# EAGLE design DomBoard (EAGLE 7.7.0)

## Sheet 1 of 2
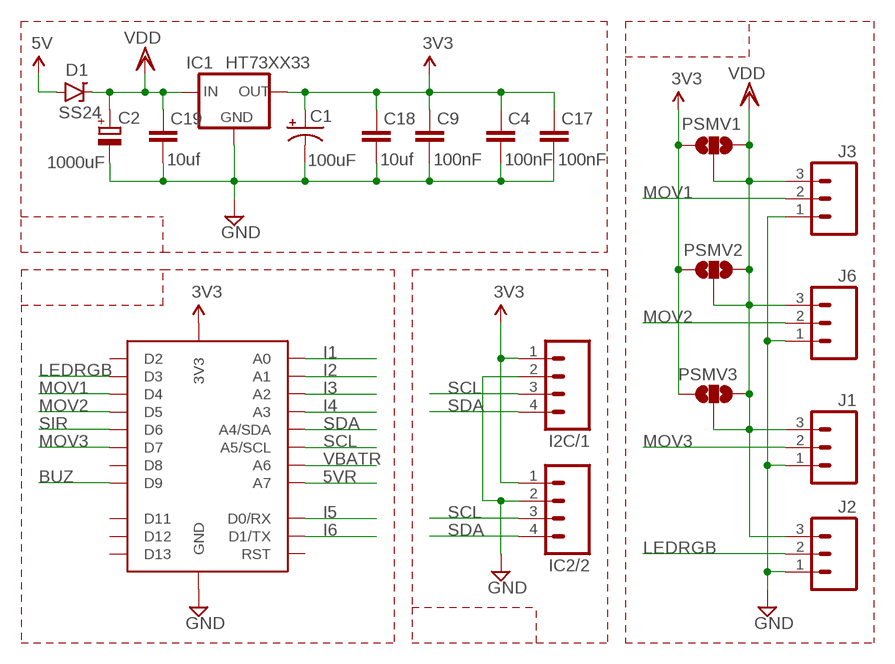
[diagram p0: schematic, sheet 1]

### Parts
C1  100uF  CAP_POL3528-KIT  [EIA3528-KIT]
C2  1000uF  CPOL-EUE5-8.5  [E5-8,5]
C4  100nF  C-EUC0805K  [C0805K]
C9  100nF  C-EUC0805K  [C0805K]
C17  100nF  C-EUC0805K  [C0805K]
C18  10uf  C-EUC0805K  [C0805K]
C19  10uf  C-EUC0805K  [C0805K]
D1  SS24  [DO-214AA(1)]
I2C/1  M04PTH  [1X04]
IC1  HT73XX33  [SOT-89]
IC2/2  M04PTH  [1X04]
J1  M03JST-PTH-VERT  [JST-3-PTH-VERT]
J2  M03JST-PTH-VERT  [JST-3-PTH-VERT]
J3  M03JST-PTH-VERT  [JST-3-PTH-VERT]
J6  M03JST-PTH-VERT  [JST-3-PTH-VERT]
PROMINI69  PROMINI69  [PROMINI69]
PSMV1  JUMPER-PAD-3-NC_BY_TRACE  [PAD-JUMPER-3-3OF3_NC_BY_TRACE_YES_SILK_FULL_BOX]
PSMV2  JUMPER-PAD-3-NC_BY_TRACE  [PAD-JUMPER-3-3OF3_NC_BY_TRACE_YES_SILK_FULL_BOX]
PSMV3  JUMPER-PAD-3-NC_BY_TRACE  [PAD-JUMPER-3-3OF3_NC_BY_TRACE_YES_SILK_FULL_BOX]

### Nets
3.3V [3.3V]: C1.A(+) C4.2 C9.2 C17.2 C18.2 I2C/1.1 IC1.1(OUT) IC2/2.1 PROMINI69.3V3 PSMV1.1 PSMV2.1 PSMV3.1 ; supply symbol labelled 3V3 ; also sheet 2
5V [5V]: D1.A ; also sheet 2
5VR: PROMINI69.A7 ; also sheet 2
BUZ: PROMINI69.D9 ; also sheet 2
GND [GND]: C1.C(-) C2.- C4.1 C9.1 C17.1 C18.1 C19.1 I2C/1.2 IC1.2(GND) IC2/2.2 J1.1 J2.1 J3.1 J6.1 PROMINI69.GND ; also sheet 2
I1: PROMINI69.A0 ; also sheet 2
I2: PROMINI69.A1 ; also sheet 2
I3: PROMINI69.A2 ; also sheet 2
I4: PROMINI69.A3 ; also sheet 2
I5: PROMINI69.D0(D0/RX) ; also sheet 2
I6: PROMINI69.D1(D1/TX) ; also sheet 2
LEDRGB: J2.2 PROMINI69.D3
MOV1: J3.2 PROMINI69.D4
MOV2: J6.2 PROMINI69.D5
MOV3: J1.2 PROMINI69.D7
SCL: I2C/1.3 IC2/2.3 PROMINI69.A5(A5/SCL) ; also sheet 2
SDA: I2C/1.4 IC2/2.4 PROMINI69.A4(A4/SDA) ; also sheet 2
SIR: PROMINI69.D6 ; also sheet 2
VBATR: PROMINI69.A6 ; also sheet 2
VDD [VDD]: C2.+ C19.2 D1.C IC1.3(IN) IC1.4(IN) J1.3 J2.3 J3.3 J6.3 PSMV1.2 PSMV1.3 PSMV2.2 PSMV2.3 PSMV3.2 PSMV3.3 ; also sheet 2
Unconnected: PROMINI69.D2 PROMINI69.D8 PROMINI69.D11 PROMINI69.D12 PROMINI69.D13 PROMINI69.RST

## Sheet 2 of 2
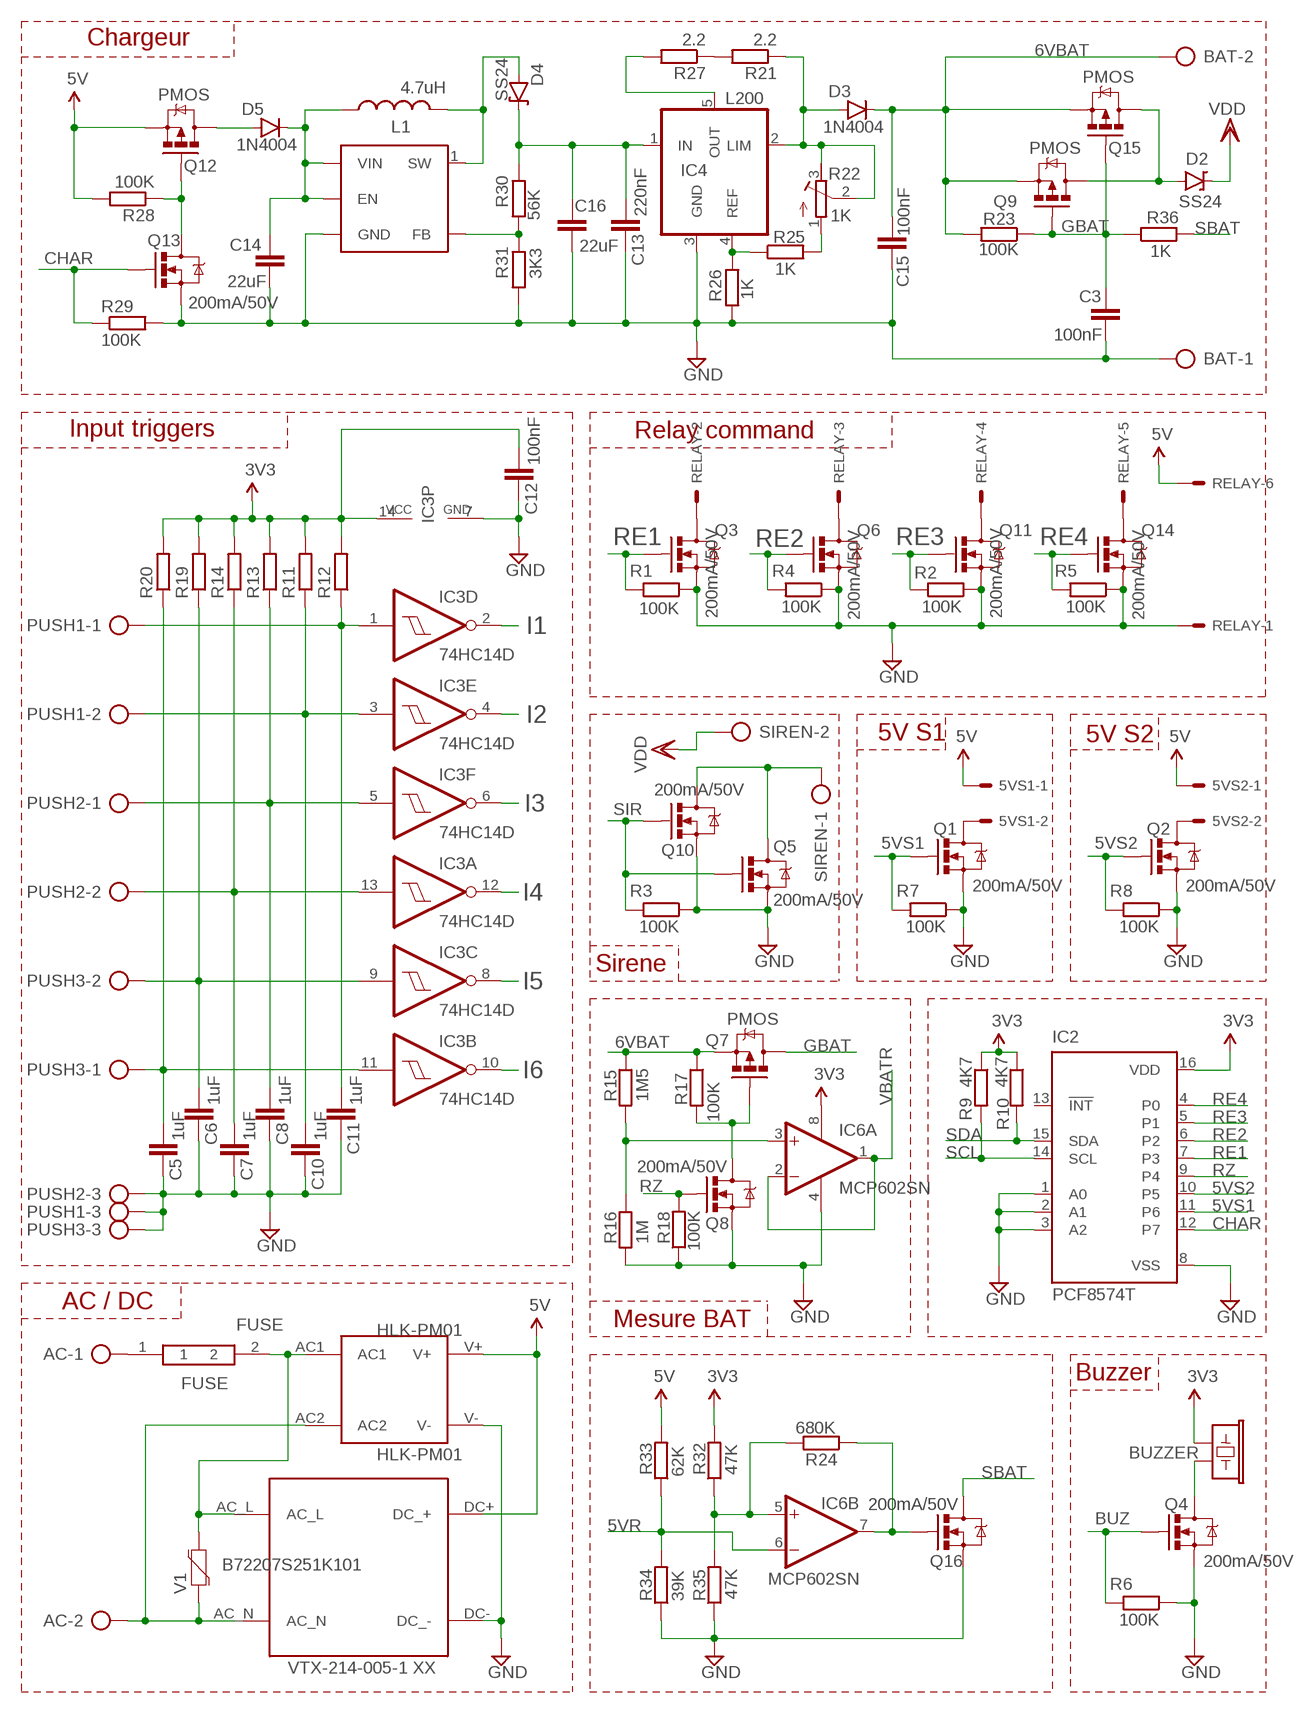
[diagram p1: schematic, sheet 2]

### Parts
5VS1  22-23-2021  [22-23-2021]
5VS2  22-23-2021  [22-23-2021]
AC  AK500/2  [AK500/2]
BAT  AK500/2  [AK500/2]
BUZZER  BUZZER  BUZZERPTH  [BUZZER-12MM]
C3  100nF  C-EUC0805K  [C0805K]
C5  1uF  C-EUC0805K  [C0805K]
C6  1uF  C-EUC0805K  [C0805K]
C7  1uF  C-EUC0805K  [C0805K]
C8  1uF  C-EUC0805K  [C0805K]
C10  1uF  C-EUC0805K  [C0805K]
C11  1uF  C-EUC0805K  [C0805K]
C12  100nF  C-EUC0805K  [C0805K]
C13  220nF  C-EUC0805K  [C0805K]
C14  22uF  C-EUC0805K  [C0805K]
C15  100nF  C-EUC0805K  [C0805K]
C16  22uF  C-EUC0805K  [C0805K]
D2  SS24  [DO-214AA(1)]
D3  1N4004  DIODE  [DO-214AA(1)]
D4  SS24  [DO-214AA(1)]
D5  1N4004  DIODE  [DO-214AA(1)]
FUSE  FUSE  [FUSE_BEL_RST5_5A]
HLK-PM01  HLK-PM01  HILINK_HLK-PM01  [HILINK_HLK-PM01]
IC2  PCF8574T  [SO16W]
IC3  74HC14D  [SO14]
IC4  L200  [L200S]
IC5  SX1308  [SOT23-6]
IC6  MCP602SN  [SO08]
L1  4.7uH  INDUCTOR  [INDUC1]
PUSH1  AK500/3  [AK500/3]
PUSH2  AK500/3  [AK500/3]
PUSH3  AK500/3  [AK500/3]
Q1  200mA/50V  N-MOSFETBSS138  [SOT23-3]
Q2  200mA/50V  N-MOSFETBSS138  [SOT23-3]
Q3  200mA/50V  N-MOSFETBSS138  [SOT23-3]
Q4  200mA/50V  N-MOSFETBSS138  [SOT23-3]
Q5  200mA/50V  N-MOSFETBSS138  [SOT23-3]
Q6  200mA/50V  N-MOSFETBSS138  [SOT23-3]
Q7  PMOS  P-MOSFET  [SOT23-3]
Q8  200mA/50V  N-MOSFETBSS138  [SOT23-3]
Q9  PMOS  P-MOSFET  [SOT23-3]
Q10  200mA/50V  N-MOSFETBSS138  [SOT23-3]
Q11  200mA/50V  N-MOSFETBSS138  [SOT23-3]
Q12  PMOS  P-MOSFET  [SOT23-3]
Q13  200mA/50V  N-MOSFETBSS138  [SOT23-3]
Q14  200mA/50V  N-MOSFETBSS138  [SOT23-3]
Q15  PMOS  P-MOSFET  [SOT23-3]
Q16  200mA/50V  N-MOSFETBSS138  [SOT23-3]
R1  100K  R-EUR0805  [R0805]
R2  100K  R-EUR0805  [R0805]
R3  100K  R-EUR0805  [R0805]
R4  100K  R-EUR0805  [R0805]
R5  100K  R-EUR0805  [R0805]
R6  100K  R-EUR0805  [R0805]
R7  100K  R-EUR0805  [R0805]
R8  100K  R-EUR0805  [R0805]
R9  4K7  R-EUR0805  [R0805]
R10  4K7  R-EUR0805  [R0805]
R11  R-EUR0805  [R0805]
R12  R-EUR0805  [R0805]
R13  R-EUR0805  [R0805]
R14  R-EUR0805  [R0805]
R15  1M5  R-EUR0805  [R0805]
R16  1M  R-EUR0805  [R0805]
R17  100K  R-EUR0805  [R0805]
R18  100K  R-EUR0805  [R0805]
R19  R-EUR0805  [R0805]
R20  R-EUR0805  [R0805]
R21  2.2  R-EUR0805  [R0805]
R22  1K  R-TRIMM3296W  [RTRIM3296W]
R23  100K  R-EUR0805  [R0805]
R24  680K  R-EUR0805  [R0805]
R25  1K  R-EUR0805  [R0805]
R26  1K  R-EUR0805  [R0805]
R27  2.2  R-EUR0805  [R0805]
R28  100K  R-EUR0805  [R0805]
R29  100K  R-EUR0805  [R0805]
R30  56K  R-EUM0805  [M0805]
R31  3K3  R-EUM0805  [M0805]
R32  47K  R-EUR0805  [R0805]
R33  62K  R-EUR0805  [R0805]
R34  39K  R-EUR0805  [R0805]
R35  47K  R-EUR0805  [R0805]
R36  1K  R-EUR0805  [R0805]
RELAY  22-23-2061  [22-23-2061]
SIREN  AK500/2  [AK500/2]
V1  B72207S251K101  VARISTOR_B72207S251K101  [VARISTOR_B72207S251K101]
VTX1  VTX-214-005-1XX  [VTX-214-005-1XX]

### Nets
3.3V [3.3V]: BUZZER.+ C12.1 IC2.16(VDD) IC3.14(P:VCC) IC6.8(P:V+) R9.1 R10.1 R11.2 R12.2 R13.2 R14.2 R19.2 R20.2 R32.2 ; supply symbol labelled 3V3 ; also sheet 1
5V [5V]: 5VS1.1 5VS2.1 HLK-PM01.V+ Q12.2(S) R28.2 R33.2 RELAY.6 VTX1.DC+(DC_+) ; also sheet 1
5VR: IC6.6(B:-IN) R33.1 R34.2 ; also sheet 1
5VS1: IC2.11(P6) Q1.1(G) R7.2
5VS2: IC2.10(P5) Q2.1(G) R8.2
6VBAT: BAT.2 C15.1 D3.C Q7.2(S) Q9.2(S) Q15.2(S) R15.1 R17.1 R23.2
BATC [power]: D2.A Q9.3(D) Q15.3(D)
BUZ: Q4.1(G) R6.2 ; also sheet 1
CHAR: IC2.12(P7) Q13.1(G) R29.1
GBAT: C3.1 Q7.3(D) Q9.1(G) Q15.1(G) R23.1 R36.1
GND [GND]: BAT.1 C3.2 C5.2 C6.2 C7.2 C8.2 C10.2 C11.2 C12.2 C13.2 C14.2 C15.2 C16.2 HLK-PM01.V- IC2.1(A0) IC2.2(A1) IC2.3(A2) IC2.8(VSS) IC3.7(P:GND) IC4.3(GND) IC5.2(GND) IC6.4(P:V-) PUSH1.3 PUSH2.3 PUSH3.3 Q1.2(S) Q2.2(S) Q3.2(S) Q4.2(S) Q5.2(S) Q6.2(S) Q8.2(S) Q10.2(S) Q11.2(S) Q13.2(S) Q14.2(S) Q16.2(S) R1.1 R2.1 R3.1 R4.1 R5.1 R6.1 R7.1 R8.1 R16.2 R18.1 R26.2 R29.2 R31.1 R34.1 R35.1 RELAY.1 VTX1.DC-(DC_-) ; also sheet 1
I1: IC3.2(D:O) ; also sheet 1
I2: IC3.4(E:O) ; also sheet 1
I3: IC3.6(F:O) ; also sheet 1
I4: IC3.12(A:O) ; also sheet 1
I5: IC3.8(C:O) ; also sheet 1
I6: IC3.10(B:O) ; also sheet 1
N$1: BUZZER.- Q4.3(D)
N$3: IC6.7(B:OUT) Q16.1(G) R24.1
N$4: C11.1 IC3.1(D:I) PUSH1.1 R12.1
N$5: C10.1 IC3.3(E:I) PUSH1.2 R11.1
N$6: Q7.1(G) Q8.3(D) R17.2
N$7: Q3.3(D) RELAY.2
N$8: Q6.3(D) RELAY.3
N$9: AC.1 FUSE.1
N$10: Q5.3(D) Q10.3(D) SIREN.1
N$11: 5VS1.2 Q1.3(D)
N$12: C8.1 IC3.5(F:I) PUSH2.1 R13.1
N$13: 5VS2.2 Q2.3(D)
N$14: C7.1 IC3.13(A:I) PUSH2.2 R14.1
N$16: C6.1 IC3.9(C:I) PUSH3.2 R19.1
N$34: C5.1 IC3.11(B:I) PUSH3.1 R20.1
N$36: R21.2 R27.1
N$38: IC4.5(OUT) R27.2
N$39: R22.1(A) R25.2
N$40: IC6.5(B:+IN) R24.2 R32.1 R35.2
N$45: Q11.3(D) RELAY.4
N$46: Q14.3(D) RELAY.5
N$47: C13.1 C16.1 D4.C IC4.1(IN) R30.2
N$52: D5.A Q12.3(D)
N$54: IC4.4(REF) R25.1 R26.1
N$55: D3.A IC4.2(LIM) R21.1 R22.2(S) R22.3(E)
N$56: Q12.1(G) Q13.3(D) R28.1
N$57: AC.2 HLK-PM01.AC2 V1.1 VTX1.AC_N
N$59: C14.1 D5.C IC5.4(EN) IC5.5(VIN) L1.1
N$60: D4.A IC5.1(SW) L1.2
N$61: IC5.3(FB) R30.1 R31.2
N$63: FUSE.2 HLK-PM01.AC1 V1.2 VTX1.AC_L
RE1: IC2.7(P3) Q3.1(G) R1.2
RE2: IC2.6(P2) Q6.1(G) R4.2
RE3: IC2.5(P1) Q11.1(G) R2.2
RE4: IC2.4(P0) Q14.1(G) R5.2
RZ: IC2.9(P4) Q8.1(G) R18.2
SBAT: Q16.3(D) R36.2
SCL: IC2.14(SCL) R9.2 ; also sheet 1
SDA: IC2.15(SDA) R10.2 ; also sheet 1
SIR: Q5.1(G) Q10.1(G) R3.2 ; also sheet 1
VBATR: IC6.1(A:OUT) IC6.2(A:-IN) ; also sheet 1
VBR: IC6.3(A:+IN) R15.2 R16.1
VDD [VDD]: D2.C SIREN.2 ; also sheet 1
Unconnected: IC2.13(!INT)

### Notes on the sheet
- Chargeur
- Input triggers | Relay command
- 5V S1 | 5V S2
- Sirene
- AC / DC
- Mesure BAT
- Buzzer

## Library data of the parts
5VS1 5VS2 = con-molex:22-23-2021: .100" (2.54mm) Center Header - 2 Pin; MF: MOLEX; MPN: 22-23-2021; OC_FARNELL: 1462926; OC_NEWARK: 25C3832
AC BAT SIREN = dom:AK500/2: CONNECTOR; OC_FARNELL: unknown; OC_NEWARK: unknown
BUZZER = dom:BUZZER: Buzzer 12mm Spark Fun Electronics SKU : Comp-Buzzer
C1 = SparkFun-Capacitors:CAP_POL: Capacitor Polarized These are standard SMD and PTH capacitors. Normally 10uF, 47uF, and 100uF in electrolytic and tantalum varieties. Always verify the external diameter of the through hole cap, it varies with capacity, voltage, and manufacturer. The EIA devices should be standard.
C2 = rcl:CPOL-EU: POLARIZED CAPACITOR, European symbol
C3-C19 = dom:C-EU: CAPACITOR, European symbol
D1 D2 D4 = dom:SS24
D3 D5 = dom:DIODE
FUSE = dom:FUSE
HLK-PM01 = dom:HILINK_HLK-PM01
I2C/1 IC2/2 = SparkFun-Connectors:M04: Header 4 Standard 4-pin 0.1" header. Use with straight break away headers (SKU : PRT-00116), right angle break away headers (PRT-00553), swiss pins (PRT-00743), machine pins (PRT-00117), and female headers (PRT-00115). Molex polarized connector foot print use with SKU : PRT-08231 with associated crimp pins and housings. 1MM SMD Version SKU: PRT-10208; PROD_ID: CONN-09696
IC1 = dom:HT73XX
IC2 = dom:PCF8574: I2C-Bus Remote 8-bit I/O expander http://www.semiconductors.philips.com/acrobat_download/datasheets/PCF8574_4.pdf; MPN: PCF8574T/3,512; OC_FARNELL: 1201255; OC_NEWARK: 70R6870
IC3 = 74xx-eu:74*14: Hex schmitt trigger INVERTER
IC4 = dom:L200: VOLTAGE REGULATOR
IC5 = dom:SX1308
IC6 = dom:MCP602: Single Op Amp 2.7V to 6.0V Single Supply CMOS Source: http://ww1.microchip.com/downloads/en/DeviceDoc/21314g.pdf
J1-J3 J6 = SparkFun-Connectors:M03: Header 3 Standard 3-pin 0.1" header. Use with straight break away headers (SKU : PRT-00116), right angle break away headers (PRT-00553), swiss pins (PRT-00743), machine pins (PRT-00117), and female headers (PRT-00115). Molex polarized connector foot print use with SKU : PRT-08232 with associated crimp pins and housings.
L1 = dom:INDUCTOR
PROMINI69 = dom:PROMINI69
PSMV1-PSMV3 = dom:JUMPER-PAD-3-NC_BY_TRACE
PUSH1-PUSH3 = dom:AK500/3: CONNECTOR; OC_FARNELL: unknown; OC_NEWARK: unknown
Q1-Q6 Q8 Q10 Q11 Q13 Q14 Q16 = dom:N-MOSFET: Common NMOSFET Parts MFG P/N Store ID Prod ID FDD8780 TRANS-09984 SI7820DN TRANS-11055 FDS6630A IC-08089 2N7002PW TRANS-11151 FQP30N06L COM-10213 TRANS-10060 BSS123LT1G TRANS-08345 BSS138 TRANS-00830 BS170 2N7000; PROD_ID: TRANS-00830
Q7 Q9 Q12 Q15 = dom:P-MOSFET: Generic PMOSFET IRLML2244 - TRANS-11153 (SOT-23 -20V -4.3A) (1.Gate 2.Source 3.Drain) FQP27P06 - COM-10349 <http://www.sparkfun.com/products/10349> (TO-220 -60V -27A) (1.Gate 2.Source 3.Drain); PROD_ID: TRANS-08285
R1-R21 R23-R36 = dom:R-EU: RESISTOR, European symbol
R22 = resistor:R-TRIMM: Trimm resistor
RELAY = con-molex:22-23-2061: .100" (2.54mm) Center Header - 6 Pin; MF: MOLEX; MPN: 22-23-2061; OC_FARNELL: 1462922; OC_NEWARK: 27C1933
V1 = dom:VARISTOR_B72207S251K101
VTX1 = dom:VTX-214-005-1XX

## Net classes
0 default: width 0.305 mm, drill 0.33 mm, clearance 0.203 mm
1 power: width 0.61 mm, drill 0.406 mm, clearance 0.203 mm
2 5V: width 0.61 mm, drill 0.406 mm, clearance 0.203 mm
3 VDD: width 0.61 mm, drill 0.406 mm, clearance 0.203 mm
4 3.3V: width 0.508 mm, drill 0.406 mm, clearance 0.203 mm
5 GND: width 0.508 mm, drill 0.61 mm, clearance 0.508 mm

## Board
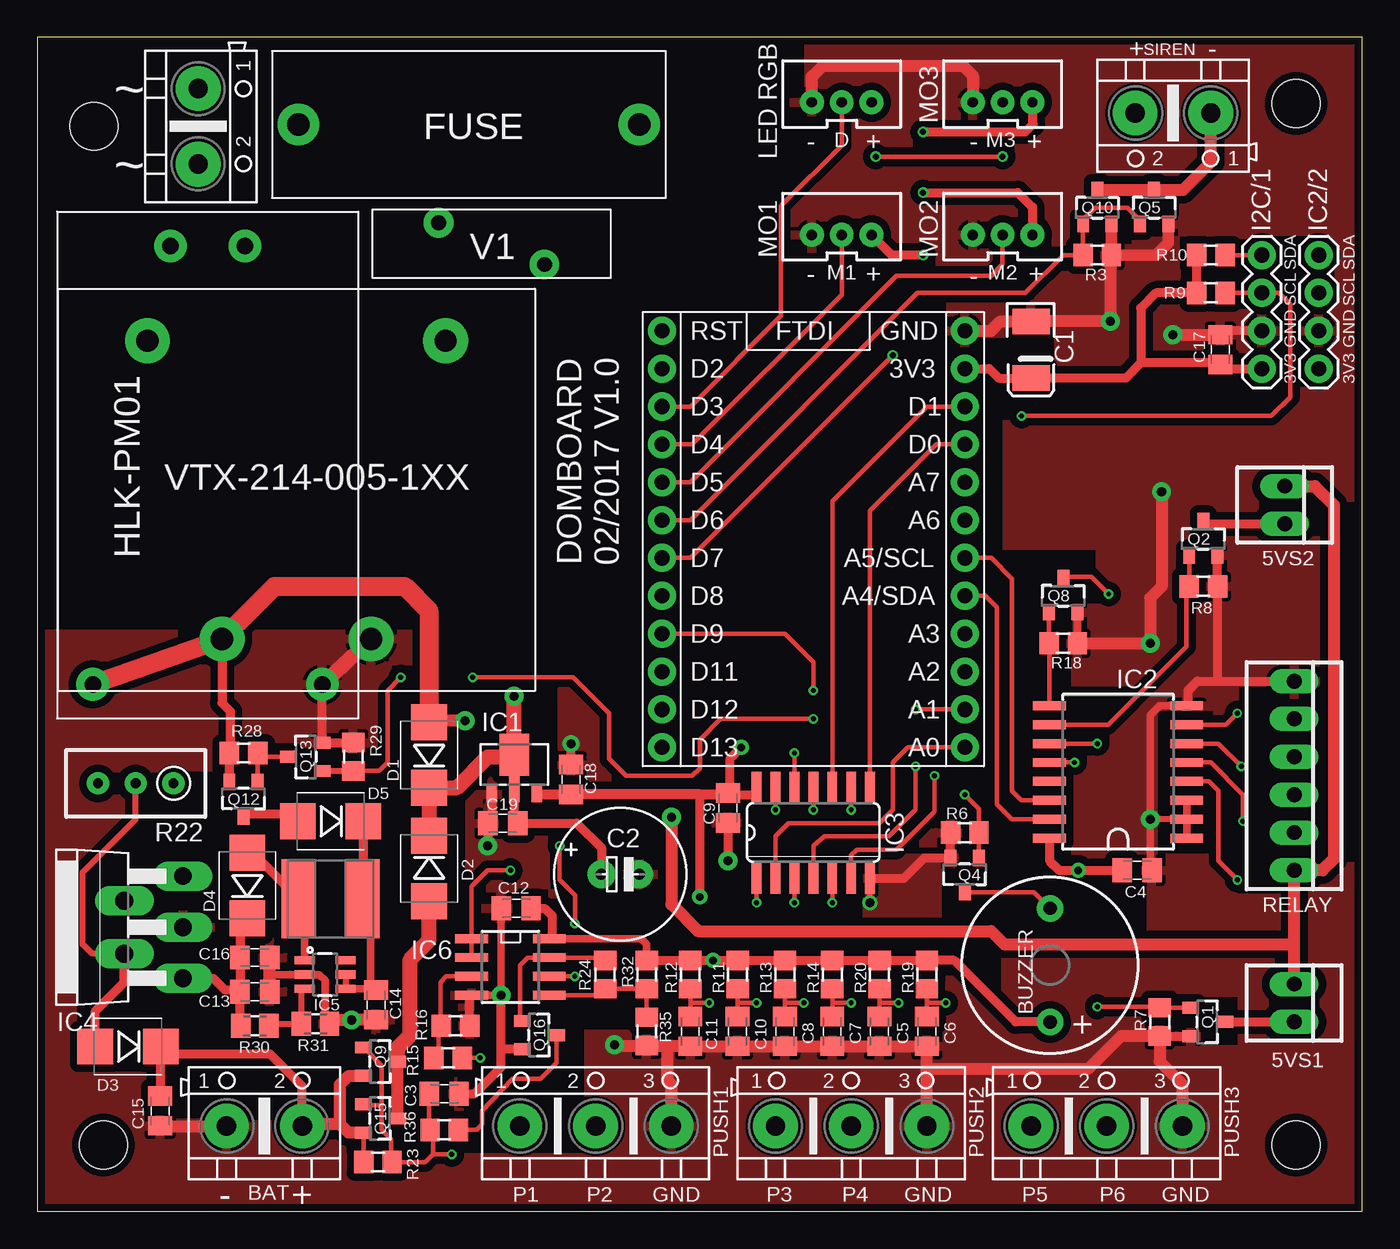
[diagram p2: board, top side]
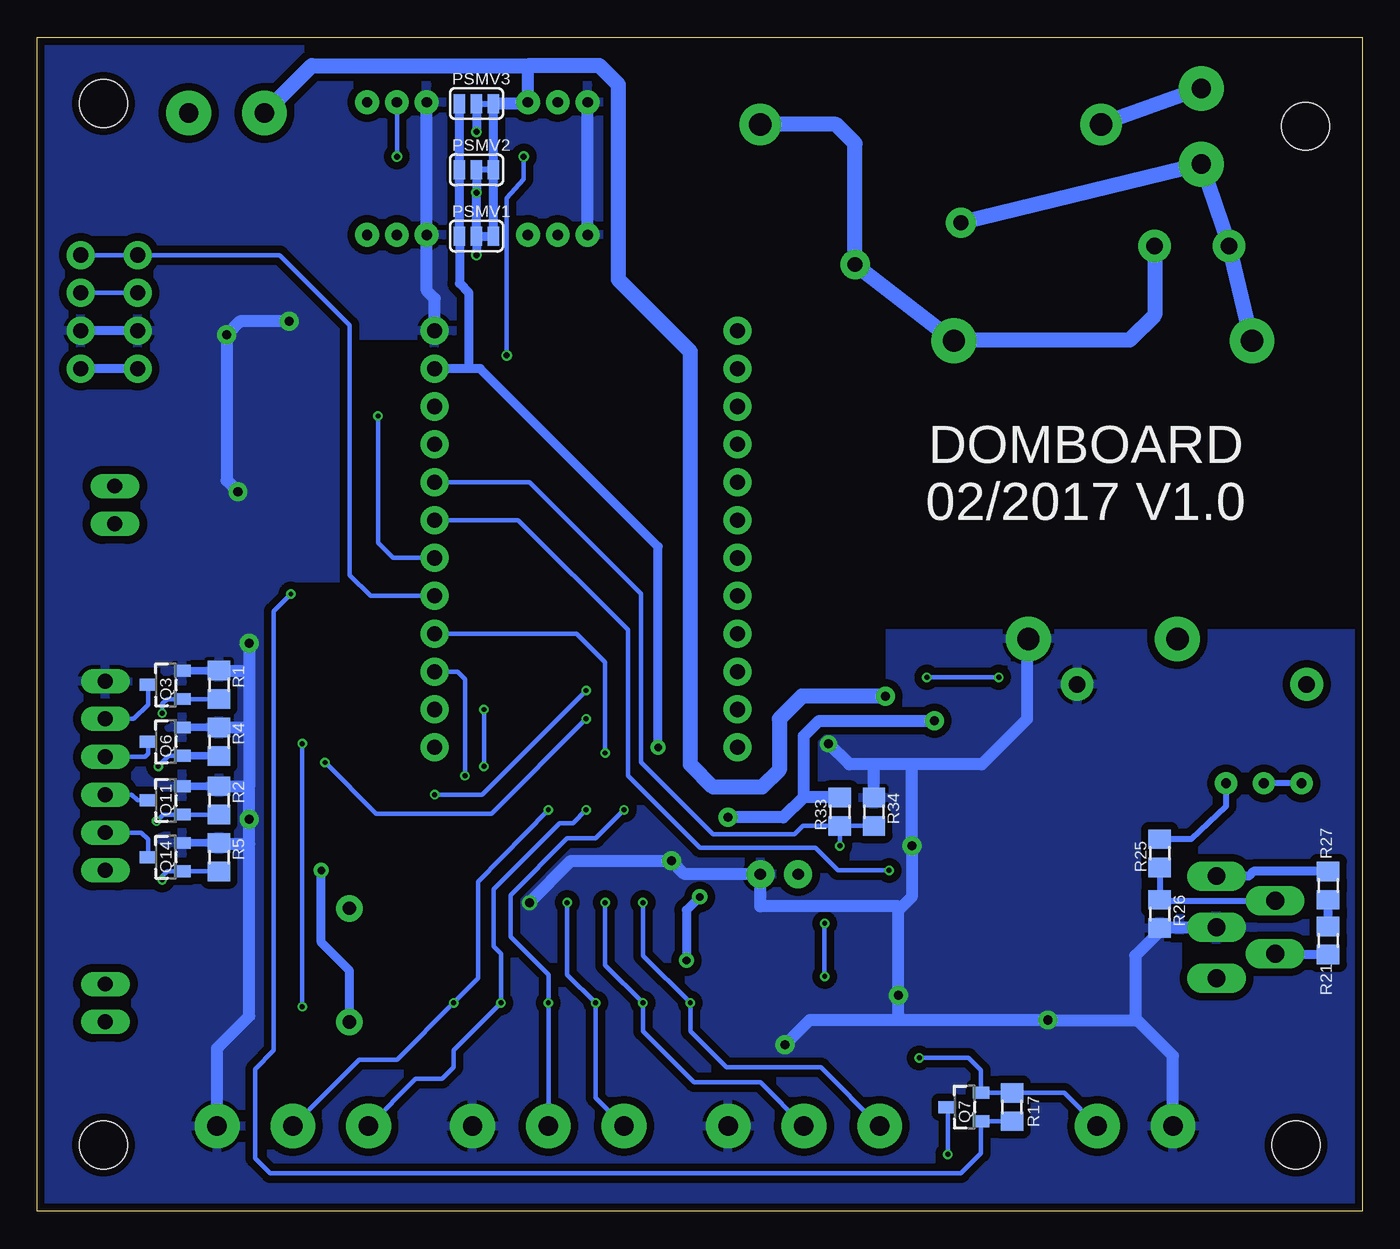
[diagram p3: board, bottom side, seen from below]

Size 88.9 x 78.74 mm. Coordinates in mm from the lower left corner, seen from the top.
Outline: 0,0 88.9,0 88.9,78.74 0,78.74 0,0
Copper layers (1*16): Top 0.035mm / dielectric 1.6mm / Bottom 0.035mm
Design rules "Elecrow_2-layer_PCB_eagle_rule *": minimum track width 10mil, minimum drill 12mil, track to track 16mil, track to pad 6mil, pad to pad 6mil, via to via 8mil, smd to smd 0mil, copper to edge 20mil, drill to drill 24mil, minimum pad ring 6mil, minimum via ring 6mil, stop-mask expansion 2.5mil, vias tented up to drill 24mil, thermal gap 10mil
Holes 3.2 mm at 4.45,4.45 3.81,72.77 84.45,74.3 84.45,4.45
tRestrict: area 18.9,18.5 to 20.3,23.2; area 18.9,25 to 20.4,27.3; area 24.6,22.1 to 26.7,23.9; area 25.1,29.7 to 27.2,31.5; area 12.4,21 to 14.6,22.7; area 16.5,16 to 16.9,16.3; area 16.5,15.5 to 16.9,15.7; area 22.7,10.9 to 24.1,11.9; area 26.9,22.1 to 27.9,23.9; area 61.2,22.1 to 64,23; area 61.8,23 to 62.5,24.4; area 76.5,12.3 to 78.7,13; 78 more areas
bRestrict: area 63.2,58 to 67.3,58.4; area 68.2,41.5 to 71.2,42.2; area 32,35.6 to 33,39.2; area 8.1,16.8 to 12.1,17.9; area 11.7,18 to 12.8,18.5; area 81,21.6 to 83.2,21.8; area 77.6,23.6 to 78.5,25.5; area 77.6,27.4 to 78.6,29.1; area 77.6,31.4 to 78.6,33.1; area 77.6,35.3 to 78.6,37; area 80.6,35.8 to 82.8,36.4; area 51.3,64.4 to 52.8,64.6; 3 more areas

### Footprints (pad centres in the part's own frame; a part is rotated, then mirrored left to right if it is on the bottom)
22-23-2021 = drill 1 long: 1 -1.27,0; 2 1.27,0
AK500/2 = drill 1.3 pad 3: 1 -2.54,0; 2 2.54,0
BUZZER-12MM = drill 0.9 pad 1.778: + 3.81,0; - -3.81,0
EIA3528-KIT = smd 1.7 x 2.5: A 1.9,0; C -1.9,0
E5-8,5 = drill 0.762 pad 1.88: + -1.27,0; - 1.27,0
C0805K = smd 1.3 x 1.6: 1 -1,0; 2 1,0
DO-214AA(1) = smd 2.4 x 2.4: A 2.2,0; C -2.2,0
FUSE_BEL_RST5_5A = drill 1.5 pad 2.8: 1 -11.43,0; 2 11.43,0
HILINK_HLK-PM01 = drill 1.1 pad 2.2: AC1 2.5,14.7; AC2 -2.5,14.7; V+ -7.7,-14.7; V- 7.7,-14.7
1X04 = drill 1.016 pad 1.88: 1 0,0; 2 2.54,0; 3 5.08,0; 4 7.62,0
SOT-89 = smd 0.7 x 1.1: 1 1.5,-2.385; 2 -1.5,-2.385 | smd 0.7 x 1.8: 3 0,-2.035 | smd 2 x 2.8: 4 0,0.265
SO16W = smd 0.6 x 2.2: 1 -4.445,-4.6; 2 -3.175,-4.6; 3 -1.905,-4.6; 4 -0.635,-4.6; 5 0.635,-4.6; 6 1.905,-4.6; 7 3.175,-4.6; 8 4.445,-4.6; 9 4.445,4.6; 10 3.175,4.6; 11 1.905,4.6; 12 0.635,4.6; 13 -0.635,4.6; 14 -1.905,4.6; 15 -3.175,4.6; 16 -4.445,4.6
SO14 = smd 0.66 x 2.032: 1 -3.81,-3.073; 2 -2.54,-3.073; 3 -1.27,-3.073; 4 0,-3.073; 5 1.27,-3.073; 6 2.54,-3.073; 7 3.81,-3.073; 8 3.81,3.073; 9 2.54,3.073; 10 1.27,3.073; 11 0,3.073; 12 -1.27,3.073; 13 -2.54,3.073; 14 -3.81,3.073
L200S = drill 1.194 long: 1 -3.429,-8.509; 2 -1.778,-4.572; 3 0,-8.509; 4 1.778,-4.572; 5 3.429,-8.509
SOT23-6 = smd 0.55 x 1.35: 1 -0.95,-1.375; 2 0,-1.375; 3 0.95,-1.375; 4 0.95,1.375; 5 0,1.375; 6 -0.95,1.375
SO08 = smd 0.6 x 2.2: 1 -1.905,-2.6; 2 -0.635,-2.6; 3 0.635,-2.6; 4 1.905,-2.6; 5 1.905,2.6; 6 0.635,2.6; 7 -0.635,2.6; 8 -1.905,2.6
JST-3-PTH-VERT = drill 0.7 pad 1.6: 1 -2,-0.55; 2 0,-0.55; 3 2,-0.55
INDUC1 = smd 2.3 x 5.3: 1 -2.15,0; 2 2.15,0
PROMINI69 = drill 1.016 pad 1.88: 3V3 11.43,12.7; A0 11.43,-12.7; A1 11.43,-10.16; A2 11.43,-7.62; A3 11.43,-5.08; A4 11.43,-2.54; A5 11.43,0; A6 11.43,2.54; A7 11.43,5.08; D0 11.43,7.62; D1 11.43,10.16; D2 -8.89,12.7; D3 -8.89,10.16; D4 -8.89,7.62; D5 -8.89,5.08; D6 -8.89,2.54; D7 -8.89,0; D8 -8.89,-2.54; D9 -8.89,-5.08; D11 -8.89,-7.62; D12 -8.89,-10.16; D13 -8.89,-12.7; GND 11.43,15.24; RST -8.89,15.24
PAD-JUMPER-3-3OF3_NC_BY_TRACE_YES_SILK_FULL_BOX = smd 0.762 x 1.27: 1 -1.143,0; 2 0,0; 3 1.143,0
AK500/3 = drill 1.3 pad 3: 1 -5.08,0; 2 0,0; 3 5.08,0
SOT23-3 = smd 0.8 x 1.1: 1 -0.95,-1.1; 2 0.95,-1.1; 3 0,1.2
R0805 = smd 1.3 x 1.5: 1 -0.95,0; 2 0.95,0
RTRIM3296W = drill 0.65 pad 1.5: 1 0,-2.54; 2 0,0; 3 0,2.54
M0805 = smd 1.3 x 1.6: 1 -0.95,0; 2 0.95,0
22-23-2061 = drill 1 long: 1 -6.35,0; 2 -3.81,0; 3 -1.27,0; 4 1.27,0; 5 3.81,0; 6 6.35,0
VARISTOR_B72207S251K101 = drill 1 pad 2: 1 -3.545,1.397; 2 3.545,-1.397
VTX-214-005-1XX = drill 1.5 pad 3: AC_L 10,10; AC_N -10,10; DC+ -5,-10; DC- 5,-10

### Placement (x,y rotation side)
5VS1  84.33,13.97 270 top
5VS2  83.69,47.37 270 top
AC  10.79,72.77 270 top
BAT  15.24,5.71 0 top
BUZZER  67.94,16.51 270 top
C1  66.67,57.78 270 top
C2  39.12,22.61 0 top
C3  27.3,7.87 0 top
C4  73.79,22.86 180 top
C5  56.52,12.06 270 top
C6  59.69,12.06 270 top
C7  53.34,12.06 270 top
C8  50.16,12.06 270 top
C9  46.35,27.05 90 top
C10  46.99,12.06 270 top
C11  43.81,12.06 270 top
C12  32.13,20.32 180 top
C13  14.61,14.73 0 top
C14  22.73,13.84 270 top
C15  8.26,6.73 270 top
C16  14.61,17.02 0 top
C17  79.38,57.78 270 top
C18  35.81,28.96 270 top
C19  31.24,26.04 0 top
D1  26.29,30.61 90 top
D2  26.29,22.99 270 top
D3  6.1,11.05 180 top
D4  14.1,21.84 90 top
D5  19.68,26.16 180 top
FUSE  28.96,72.9 0 top
HLK-PM01  11.43,50.04 0 top
I2C/1  82.17,56.52 90 top
IC1  32,30.35 0 top
IC2  72.52,29.46 90 top
IC2/2  85.98,56.52 90 top
IC3  52.07,25.4 0 top
IC4  1.27,19.05 90 top
IC5  19.3,15.88 270 top
IC6  31.75,16.38 270 top
J1  64.77,74.93 0 top
J2  53.98,74.93 0 top
J3  53.98,66.04 0 top
J6  64.77,66.04 0 top
L1  19.68,20.95 180 top
PROMINI69  50.8,43.81 0 top
PSMV1  59.44,65.41 0 bottom
PSMV2  59.44,69.85 0 bottom
PSMV3  59.44,74.3 0 bottom
PUSH1  37.47,5.71 0 top
PUSH2  54.61,5.71 0 top
PUSH3  71.75,5.71 0 top
Q1  78.49,12.7 270 top
Q2  78.23,45.09 0 top
Q3  80.26,35.31 90 bottom
Q4  62.23,22.61 180 top
Q5  74.93,67.31 0 top
Q6  80.26,31.5 90 bottom
Q7  26.67,6.99 90 bottom
Q8  68.83,41.27 0 top
Q9  22.99,10.03 270 top
Q10  71.12,67.31 0 top
Q11  80.26,27.56 90 bottom
Q12  13.84,27.69 180 top
Q13  18.03,30.48 90 top
Q14  80.26,23.75 90 bottom
Q15  22.99,6.22 270 top
Q16  33.66,11.81 270 top
R1  76.71,35.31 270 bottom
R2  76.71,27.56 270 bottom
R3  71.12,64.14 180 top
R4  76.71,31.5 270 bottom
R5  76.71,23.75 270 bottom
R6  62.23,25.4 0 top
R7  75.31,12.7 90 top
R8  78.23,41.91 180 top
R9  78.74,61.59 0 top
R10  78.74,64.14 0 top
R11  46.99,15.88 90 top
R12  43.81,15.88 90 top
R13  50.16,15.88 90 top
R14  53.34,15.88 90 top
R15  27.56,10.29 180 top
R16  28.07,12.45 0 top
R17  23.5,6.99 270 bottom
R18  68.83,38.1 180 top
R19  59.69,15.88 90 top
R20  56.52,15.88 90 top
R21  2.29,18.16 90 bottom
R22  6.6,28.7 90 top
R23  22.86,3.3 180 top
R24  38.1,15.88 270 top
R25  13.59,24 90 bottom
R26  13.59,19.94 270 bottom
R27  2.29,21.84 90 bottom
R28  13.84,30.73 180 top
R29  21.21,30.48 90 top
R30  14.61,12.45 180 top
R31  18.67,12.57 180 top
R32  40.89,15.88 90 top
R33  35.05,26.8 90 bottom
R34  32.77,26.8 270 bottom
R35  40.89,12.06 90 top
R36  27.3,5.46 0 top
RELAY  84.33,29.21 270 top
SIREN  76.2,73.66 180 top
V1  30.48,64.9 0 top
VTX1  17.4,48.39 0 top

### Tracks (layer width: path | path; a pad name or v marks a point on that pad's centre or on a via)
3.3V  (via drill 0.51 pad 1.02)
  Top 0.406: 48.26,27.94 IC3.14
  Top 0.508: 34.54,18.29 40.51,18.29 40.89,17.91 R32.2
  Top 0.61: C18.2 35.86,27.96 | C4.2 v69.85,22.86 68.58,22.86 67.92,23.52 IC2.16 | v44.45,21.08 44.45,27.96 | C9.2 46.48,27.94 48.26,27.94 | I2C/1.1 79.64,56.52 C17.2 79.26,56.9 74.04,56.9 | R10.1 R9.1 75.06,61.59 74.04,60.58 74.04,56.9 | PROMINI69.3V3 63.88,56.52 64.51,55.88 C1.A 73.03,55.88 74.04,56.9 | 46.26,27.96 arc90 C9.2 | C9.2 46.48,28.18 46.48,30.35 v47.24,31.11 | BUZZER.+ 65.66,12.7 61.53,16.82 R19.2 R20.2 R14.2 R13.2 R11.2 v45.34,16.82 R12.2 R32.2 | C12.1 34.04,20.32 34.54,19.81 34.54,18.29 IC6.8
  Top 0.66: IC1.1 C18.2 | 35.86,27.96 44.45,27.96 46.26,27.96
  Bottom 0.61: BUZZER.+ 67.94,16.13 69.85,18.03 v69.85,22.86 | I2C/1.1 IC2/2.1 | 60.83,56.52 PROMINI69.3V3 59.94,56.52 | PSMV3.1 PSMV2.1 PSMV1.1 60.58,62.23 59.94,61.59 59.94,56.52 | v47.24,31.11 47.24,44.58 59.18,56.52 59.94,56.52 | v44.45,21.08 45.34,20.19 v45.34,16.82
5V  (via drill 0.61 pad 1.27)
  Top 0.61: Q12.2 R28.2 12.95,30.8 12.95,33.53 12.4,34.08 VTX1.DC+ | 84.2,17.91 84.33,17.65
  Top 0.813: v42.55,26.42 42.55,20.57 44.32,18.8 64.01,18.8 64.9,17.91 84.2,17.91 | 5VS1.1 84.33,17.65 RELAY.6 86.23,22.86 87,23.62 87,47.37 85.72,48.64 5VS2.1 | v28.7,32.89 26.58,32.89 D1.A
  Top 1.27: HLK-PM01.V+ VTX1.DC+ 15.92,41.91 24.64,41.91 26.29,40.26 D1.A
  Bottom 0.61: 35.12,27.81 arc90 R33.2
  Bottom 0.813: v42.55,26.42 38.86,26.42 37.47,27.81 | 37.47,27.81 37.47,31.88 36.45,32.89 v28.7,32.89 | 37.47,27.81 35.12,27.81
5VR  (via drill 0.33)
  Top 0.305: IC6.6 v36.07,15.75 | v36.07,19.3 36.07,21.21 35.05,22.23 v35.05,24.51
  Bottom 0.305: PROMINI69.A7 55.88,48.9 48.39,41.4 48.39,30.1 43.56,25.27 38.1,25.27 37.53,25.85 R33.1 | R34.2 R33.1 | v36.07,15.75 v36.07,19.3 | v35.05,24.51 R33.1
5VS1  (via drill 0.33)
  Top 0.305: Q1.1 R7.2 arc90 76.01,13.72 v71.12,13.72 | IC2.11 v71.12,31.37
  Bottom 0.305: v71.12,31.37 v71.12,13.72
5VS2
  Top 0.305: Q2.1 R8.2 77.09,41.72 77.09,37.85 71.88,32.64 IC2.10
6VBAT  (via drill 0.33)
  Top 0.305: Q15.2 21.91,5.25 R23.2 | v29.72,10.29 R15.1
  Top 0.61: C15.1 8.3,7.77 8.3,10.54 | 8.3,10.54 D3.C | 8.3,10.54 15.62,10.54 17.78,8.38 BAT.2 17.78,5.84
  Top 0.813: Q15.2 20.89,5.27 20.32,5.84 | 20.32,5.84 20.32,8.51 20.89,9.08 Q9.2 | 20.32,5.84 17.78,5.84
  Bottom 0.305: BAT.2 20,7.93 R17.1 Q7.2 25.57,9.44 26.42,10.29 v29.72,10.29
BATC
  Top 0.813: Q15.3 Q9.3
  Top 1.016: Q9.3 24.19,10.98 25.02,11.81 25.02,16.89 26.29,18.16 D2.A
BUZ  (via drill 0.33)
  Top 0.305: Q4.1 R6.2 63.18,26.99 v62.23,27.94 | PROMINI69.D9 50.16,38.73 52.07,36.83 v52.07,34.92
  Bottom 0.305: v52.07,34.92 59.05,27.94 v62.23,27.94
CHAR  (via drill 0.33)
  Top 0.305: v29.21,35.81 35.94,35.81 38.35,33.4 38.35,30.35 39.5,29.21 43.94,29.21 44.45,29.72 44.45,31.62 45.85,33.02 v52.07,33.02 | IC2.12 v69.6,30.1 | v24.38,35.81 23.5,34.92 23.5,30.1 22.93,29.53 R29.1
  Top 0.406: Q13.1 R29.1
  Bottom 0.305: v69.6,30.1 66.17,26.67 58.42,26.67 v52.07,33.02 | v29.21,35.81 v24.38,35.81
GBAT  (via drill 0.33)
  Top 0.305: 23.11,7.11 23.11,9.76 Q9.1 | 23.11,7.11 21.89,7.11 Q15.1 | C3.1 26.3,5.38 R36.1 26.48,4.95 26.54,4.89 26.54,3.81 | 23.11,7.11 23.11,5.46 23.75,4.83 23.75,3.11 R23.1 26.04,3.3 26.54,3.81 | v27.81,3.81 26.54,3.81
  Bottom 0.305: Q7.3 27.81,6.93 v27.81,3.81
GND  (via drill 0.61, 0.61 pad 1.14, 0.61 pad 1.27)
  Top 0.305: 79.64,59.05 arc90 C17.1
  Top 0.406: v55.88,20.7 IC3.7 | 77.22,34.04 IC2.8 | IC2.2 v74.68,26.29
  Top 0.508: IC2.1 IC2.2 IC2.3 | IC2.8 75.31,33.91 74.68,33.27 v74.68,26.29 74.68,22.92 | 15.61,15.88 IC5.2 18.92,15.88 19.3,15.49 19.3,12.89 arc90 R31.1 | Q8.2 R18.1 | 31.11,20.32 v31.11,14.48 IC6.4 29.02,14.35
  Top 0.61: R29.2 Q13.2 19.13,31.53 HLK-PM01.V- | C9.1 v46.35,23.5 | R6.1 Q4.2 59.52,23.71 58.14,22.33 IC3.7 | IC1.2 30.5,26.3 C19.1 30.24,24.51 v30.23,24.51 | C14.2 22.75,12.83 | C18.1 v35.81,31.37 | R7.1 Q1.2 | Q2.2 R8.1 79.18,35.56 | 77.22,34.04 77.22,34.92 77.85,35.56 79.18,35.56 | 79.18,35.56 RELAY.1 | I2C/1.2 79.64,59.05 | C15.2 8.27,5.71 | 21.23,12.84 v21.08,12.83 | C4.1 arc-90 74.68,22.92 | C1.C | 43.81,11.12 C11.2 | R16.2 29.02,14.35 | Q16.2 31.24,10.86 | 31.24,10.86 31.11,10.86 v31.11,14.48 | C3.2 29.34,7.87 31.11,9.65 31.11,10.73 31.24,10.86
  Top 0.762: Q10.2 R3.1 75.06,64.14 75.88,64.96 Q5.2
  Top 0.813: 22.48,12.83 C14.2 21.23,12.84 | C11.2 C10.2 C8.2 C7.2 C5.2 C6.2 | v75.44,48.26 75.44,41.91 74.68,41.15 v74.68,38.1 R18.1 | v76.2,58.8 76.22,58.78 C17.1 | C13.2 15.61,15.88 C16.2 | 8.27,5.71 BAT.1 | C1.C v72.01,59.69 72.01,64.07 R3.1 | PROMINI69.GND 64.01,59.05 64.64,59.69 C1.C | J2.1 51.98,76.11 52.7,76.83 62.1,76.83 62.77,76.17 J1.1 | PUSH2.3 59.69,9.53 | 59.69,9.53 C6.2 | C6.2 59.71,11.05 | 31.11,20.32 C12.2 | 59.69,9.53 70.48,9.53 72.71,11.75 R7.1 75.31,10.03 76.83,8.51 PUSH3.3 | 42.29,11.12 R35.1 38.8,11.12 v38.73,11.18 | 42.29,11.12 43.81,11.12 | PUSH1.3 42.55,8.51 42.29,8.76 42.29,11.12 | v21.08,12.83 19.87,12.83 arc90 R31.1
  Top 1.016: HLK-PM01.V- VTX1.DC-
  Bottom 0.508: Q6.2 R4.1 | Q3.2 R1.1 | Q11.2 R2.1 | R5.1 Q14.2
  Bottom 0.61: 24.26,12.83 24.38,12.83 | 30.23,29.84 30.35,29.97 | 22.48,38.31 VTX1.DC- | I2C/1.2 IC2/2.2 | 30.86,20.45 31.11,20.45 | R5.1 76.71,24.64
  Bottom 0.813: IC4.3 13.53,19.05 R26.2 13.59,18.8 15.24,17.14 15.24,12.95 | 15.24,12.95 15.24,12.83 v21.08,12.83 24.38,12.83 31.11,12.83 | 76.58,36.32 R1.1 74.68,36.26 | v55.88,20.7 53.09,23.5 v46.35,23.5 45.47,22.61 C2.- 40.39,20.45 31.11,20.45 v31.11,14.48 31.11,12.83 | R2.1 74.68,28.51 | R4.1 74.68,32.45 | 74.68,32.45 74.68,28.51 | 74.68,36.26 74.68,32.45 | v74.68,38.1 74.68,36.26 | 32.77,29.97 30.35,29.97 25.53,29.97 22.48,33.02 22.48,38.31 | 32.77,29.97 34.42,29.97 v35.81,31.37 | 30.23,29.84 v30.23,24.51 30.23,21.08 30.86,20.45 | J3.1 J2.1 | v75.44,48.26 76.2,49.02 v76.2,58.8 75.31,59.69 v72.01,59.69 | BAT.1 12.7,10.41 15.24,12.95 | PUSH3.3 76.83,10.92 74.68,13.08 74.68,24.64 | 76.71,24.64 74.68,24.64 | 74.68,24.64 v74.68,26.29 74.68,28.51 | J1.1 J6.1 62.77,61.75 62.23,61.21 PROMINI69.GND | 31.11,12.83 37.08,12.83 v38.73,11.18 | R34.1 32.77,29.97
  pour Top: 0,0 0,38.1 0,38.73 39.37,38.73 43.81,43.18 45.09,44.45 45.09,57.78 50.16,62.87 50.8,63.5 50.8,78.74 88.9,78.74 88.9,0
  pour Bottom: 0,0 0,38.73 39.37,38.73 45.09,44.45 45.09,52.7 45.09,57.78 50.8,63.5 50.8,78.74 53.98,78.74 88.9,78.74 88.9,0 85.09,0
I1
  Top 0.305: PROMINI69.A0 58.42,31.11 57.4,30.1 57.4,26.92 56.52,26.04 50.42,26.04 49.53,25.15 IC3.2
I2  (via drill 0.33)
  Top 0.305: IC3.4 52.07,24.51 52.83,25.15 57.15,25.15 58.93,26.92 v58.93,29.84 | v58.93,33.66 PROMINI69.A1
  Bottom 0.305: v58.93,29.84 v58.93,33.66
I3  (via drill 0.33)
  Top 0.305: IC3.6 54.61,23.88 54.99,24.26 57.66,24.26 60.2,26.8 v60.2,29.21
  Bottom 0.305: v60.2,29.21 60.2,35.69 60.71,36.2 PROMINI69.A2
I4  (via drill 0.33)
  Top 0.305: v50.8,30.73 IC3.12
  Bottom 0.305: PROMINI69.A3 52.7,38.73 50.8,36.83 v50.8,30.73
I5
  Top 0.305: IC3.8 55.88,46.99 60.33,51.44 PROMINI69.D0
I6
  Top 0.305: IC3.10 53.34,47.62 59.69,53.98 PROMINI69.D1
LEDRGB
  Top 0.305: PROMINI69.D3 43.81,53.98 49.91,60.07 49.91,67.44 53.98,71.5 J2.2
MOV1
  Top 0.305: PROMINI69.D4 43.94,51.44 53.98,61.47 J3.2
MOV2
  Top 0.305: PROMINI69.D5 43.81,48.9 57.66,62.74 64.01,62.74 64.77,63.5 J6.2
MOV3  (via drill 0.41)
  Top 0.305: v64.77,70.74 v56.26,70.74 | v57.4,57.4 43.81,43.81 PROMINI69.D7
  Bottom 0.305: J1.2 v64.77,70.74 | v56.26,70.74 56.26,69.22 57.4,67.94 v57.4,57.4
N$1
  Top 0.305: BUZZER.- 66.86,21.41 Q4.3
N$3
  Top 0.305: R24.1 37.59,17.02 IC6.7 32.89,17.02 32.38,16.51 32.38,12.76 Q16.1
N$4  (via drill 0.33)
  Top 0.305: IC3.1 v48.26,20.7 | C11.1 43.81,13.97 | 43.81,13.97 R12.1 | 43.81,13.97 v45.09,13.97
  Bottom 0.305: PUSH1.1 36.32,9.65 42.67,9.65 45.09,12.06 v45.09,13.97 48.26,17.14 v48.26,20.7
N$5  (via drill 0.33)
  Top 0.305: IC3.3 v50.8,20.7 | C10.1 46.99,13.97 | 46.99,13.97 R11.1 | v48.26,13.97 46.99,13.97
  Bottom 0.305: PUSH1.2 40.39,8.64 44.83,8.64 48.26,12.06 v48.26,13.97 50.8,16.51 v50.8,20.7
N$6  (via drill 0.33)
  Top 0.305: Q8.3 69.28,42.55 70.74,42.55 v71.88,41.4
  Bottom 0.305: v71.88,41.4 73.03,40.26 73.03,10.79 74.3,9.53 74.3,3.56 73.28,2.54 26.92,2.54 25.57,3.89 Q7.1 R17.2
N$7
  Bottom 0.305: Q3.3 81.46,33.98 82.42,33.02 RELAY.2
N$8
  Bottom 0.305: Q6.3 81.46,30.68 81.66,30.48 RELAY.3
N$9
  Bottom 1.016: AC.1 FUSE.1
N$10
  Top 0.813: Q10.3 Q5.3 76.89,68.51 78.74,70.36 SIREN.1
N$11
  Top 0.61: Q1.3 5VS1.2
N$12  (via drill 0.33)
  Top 0.305: IC3.5 v53.34,20.7 | R13.1 50.16,13.97 | 50.16,13.97 C8.1 | 50.16,13.97 v51.44,13.97
  Bottom 0.305: PUSH2.1 51.44,7.62 v51.44,13.97 53.34,15.88 v53.34,20.7
N$13
  Top 0.305: Q2.3 78.32,46.1
  Top 0.61: 78.32,46.1 5VS2.2
N$14  (via drill 0.33)
  Top 0.305: IC3.13 v49.53,26.92 | R14.1 53.34,13.97 | 53.34,13.97 C7.1 | 53.34,13.97 v54.61,13.97
  Bottom 0.305: v49.53,26.92 51.44,25.02 53.34,25.02 57.15,21.21 57.15,18.41 54.61,15.88 v54.61,13.97 PUSH2.2
N$16  (via drill 0.33)
  Top 0.305: v54.61,26.92 IC3.9 | R19.1 59.69,13.97 | 59.69,13.97 C6.1 | 59.69,13.97 v60.96,13.97
  Bottom 0.305: v54.61,26.92 59.31,22.1 59.31,15.62 v60.96,13.97 64.77,10.16 67.31,10.16 PUSH3.2
N$34  (via drill 0.33)
  Top 0.305: v52.07,26.92 IC3.11 | R20.1 56.52,13.97 | 56.52,13.97 C5.1 | 56.52,13.97 v57.78,13.97
  Bottom 0.305: v52.07,26.92 52.96,26.04 53.85,26.04 58.29,21.59 58.29,17.78 57.78,17.27 v57.78,13.97 60.96,10.79 60.96,9.65 61.72,8.89 63.5,8.89 PUSH3.1
N$36
  Bottom 0.61: R21.2 R27.1
N$38
  Bottom 0.406: 9.72,22.54 IC4.5
  Bottom 0.61: R27.2 7.3,22.79 7.62,22.48 IC4.5
N$39
  Bottom 0.406: R22.1 9.14,27.18 11.5,24.95 R25.2
N$40
  Top 0.305: IC6.5 37.59,14.48 R24.2 R32.1 R35.2
N$45
  Bottom 0.305: Q11.3 82.17,27.56 82.55,27.94 RELAY.4
N$46
  Bottom 0.305: Q14.3 81.46,24.95 81.92,25.4 RELAY.5
N$47
  Top 0.305: 13.48,14.86 C13.1 | D4.C 13.61,19.15 | R30.2 13.61,12.5
  Top 0.61: IC4.1 11.81,15.62 12.57,14.86 13.48,14.86 | 13.61,19.15 C16.1 C13.1 13.61,12.5
N$52
  Top 0.305: Q12.3 13.93,26.67 | 17.53,26.67 17.48,26.63 D5.A
  Top 0.61: 13.93,26.67 17.53,26.67
N$54
  Bottom 0.406: R25.1 R26.1 13.59,20.83 IC4.4
N$55
  Top 0.406: IC4.2 3.68,17.27 3.05,17.91 3.05,22.73 4.06,23.75 6.6,26.29 R22.2
  Top 0.61: D3.A 3.9,13.42 5.84,15.37 IC4.2
  Bottom 0.406: R22.3 R22.2
  Bottom 0.508: 5.78,17.21 IC4.2
  Bottom 0.61: R21.1 5.78,17.21
N$56
  Top 0.305: Q12.1 R28.1 arc90 15.05,30.48 Q13.3
N$57
  Bottom 1.016: V1.1 AC.2 HLK-PM01.AC2 VTX1.AC_N
N$59
  Top 0.305: 22.35,20.83 21.97,20.83 L1.1
  Top 0.406: C14.1 22.35,14.72 22.05,14.93 | 22.35,20.83 22.35,20.95 | IC5.5 IC5.4 | L1.1 21.89,21
  Top 0.508: 22.35,14.72 22.35,20.83 | 22.05,14.93 IC5.4
  Top 0.61: 21.89,21 D5.C
N$60
  Top 0.406: D4.A 14.45,24.04
  Top 0.508: IC5.1 17.93,20.56
  Top 0.61: 14.45,24.04 L1.2 17.93,20.56
N$61
  Top 0.406: IC5.3 17.85,14.93 17.72,14.8 R31.2 15.68,12.57
  Top 0.61: R30.1 15.68,12.57
N$63
  Bottom 1.016: FUSE.2 35.31,72.9 34.02,71.62 V1.2 VTX1.AC_L 27.37,58.42 15.62,58.42 13.93,60.11 HLK-PM01.AC1
RE1  (via drill 0.33)
  Top 0.305: IC2.7 79.76,32.64 v80.52,33.4
  Bottom 0.305: R1.2 Q3.1 80.2,34.36 80.52,34.04 v80.52,33.4
RE2  (via drill 0.33)
  Top 0.305: IC2.6 79.25,31.37 v80.77,29.84
  Bottom 0.305: v80.77,29.84 80.07,30.55 Q6.1
  Bottom 0.508: R4.2 Q6.1
RE3  (via drill 0.33)
  Top 0.305: IC2.5 78.74,30.1 80.9,27.94 v80.9,26.16
  Bottom 0.305: R2.2 Q11.1 80.45,26.61 v80.9,26.16
RE4  (via drill 0.33)
  Top 0.305: IC2.4 78.61,28.83 79.25,28.19 79.25,23.5 v80.52,22.23
  Bottom 0.305: R5.2 Q14.1 80.2,22.8 80.52,22.48 v80.52,22.23
RZ
  Top 0.305: Q8.1 R18.2 67.92,38.07 IC2.9
SBAT
  Top 0.305: Q16.3 34.85,9.96 33.78,8.89 31.88,8.89 29.84,6.73 29.84,5.84 29.46,5.46 R36.2
SCL  (via drill 0.33)
  Top 0.305: PROMINI69.A5 64.01,43.81 65.41,42.42 65.41,28.19 66.04,27.56 IC2.14 | R9.2 I2C/1.3 83.31,61.59 84.07,60.83 84.07,54.61 82.8,53.34 v66.04,53.34
  Bottom 0.305: I2C/1.3 IC2/2.3 | v66.04,53.34 66.04,44.83 65.02,43.81 PROMINI69.A5
SDA
  Top 0.305: PROMINI69.A4 63.63,41.27 64.39,40.51 64.39,27.3 65.41,26.29 IC2.15 | R10.2 I2C/1.4
  Bottom 0.305: IC2/2.4 I2C/1.4 72.64,64.14 67.94,59.44 67.94,42.67 66.55,41.27 PROMINI69.A4
SIR
  Top 0.305: PROMINI69.D6 43.81,46.35 59.05,61.59 66.29,61.59 68.83,64.14 R3.2 Q10.1 70.17,66.49 70.99,67.31 73.15,67.31 73.79,66.67 73.79,66.4 Q5.1
VBATR  (via drill 0.33)
  Top 0.305: IC6.2 IC6.1 29.15,21.78 30.23,22.86 v31.75,22.86
  Bottom 0.305: PROMINI69.A6 56.64,46.35 49.28,38.99 49.28,29.21 44.45,24.38 36.7,24.38 35.18,22.86 v31.75,22.86
VBR
  Top 0.305: IC6.3 27.43,15.75 27.05,15.37 27.05,12.51 R16.1 26.92,12.25 26.92,10.29 R15.2
VDD  (via drill 0.41, 0.61 pad 1.27)
  Top 0.305: 32,26.27 arc90 C19.2
  Top 0.61: 32,26.27 IC1.3 31.87,30.48 IC1.4 | C19.2 36.2,26.04 37.85,24.38 C2.+ | v59.44,64.14 57.33,64.14 J3.3 | v59.44,68.33 65.79,68.33 66.77,67.34 J6.3 | v59.44,72.39 66.29,72.39 66.8,72.9 66.8,74.35 J1.3
  Top 1.016: D2.C D1.C 28.15,28.41 30.23,30.48 31.87,30.48 | IC1.4 v32,34.54
  Bottom 0.406: PSMV3.2 PSMV3.3 | PSMV2.3 PSMV2.2
  Bottom 0.61: PSMV3.3 PSMV2.3 PSMV1.3 PSMV1.2 | PSMV2.2 v59.44,68.33 PSMV1.2 | PSMV1.2 v59.44,64.14 | PSMV3.2 v59.44,72.39
  Bottom 0.813: PSMV3.3 56.06,74.3 J2.3 55.98,76.74 55.88,76.83
  Bottom 1.016: v32,34.54 37.59,34.54 39.12,33.02 39.12,29.59 40.26,28.45 43.56,28.45 45.09,29.97 45.09,57.66 49.91,62.48 49.91,75.56 51.18,76.83 55.88,76.83 70.48,76.83 SIREN.2

### Text on the board
tPlace: +
tNames: + | - | LED RGB | MO3 | ~ | - | D | + | - | M3 | + | ~ | MO1 | MO2 | - | M1 | + | M2 | + | - | SDA | SDA | SCL | SCL | GND | GND | 3V3 | 3V3 | DOMBOARD / 02/2017 V1.0 | P1 | P2 | GND | P3 | P4 | GND | P5 | P6 | GND | - | +
bNames: DOMBOARD / 02/2017 V1.0